# Altium schematic sheet AUC3.SchDoc
size A4
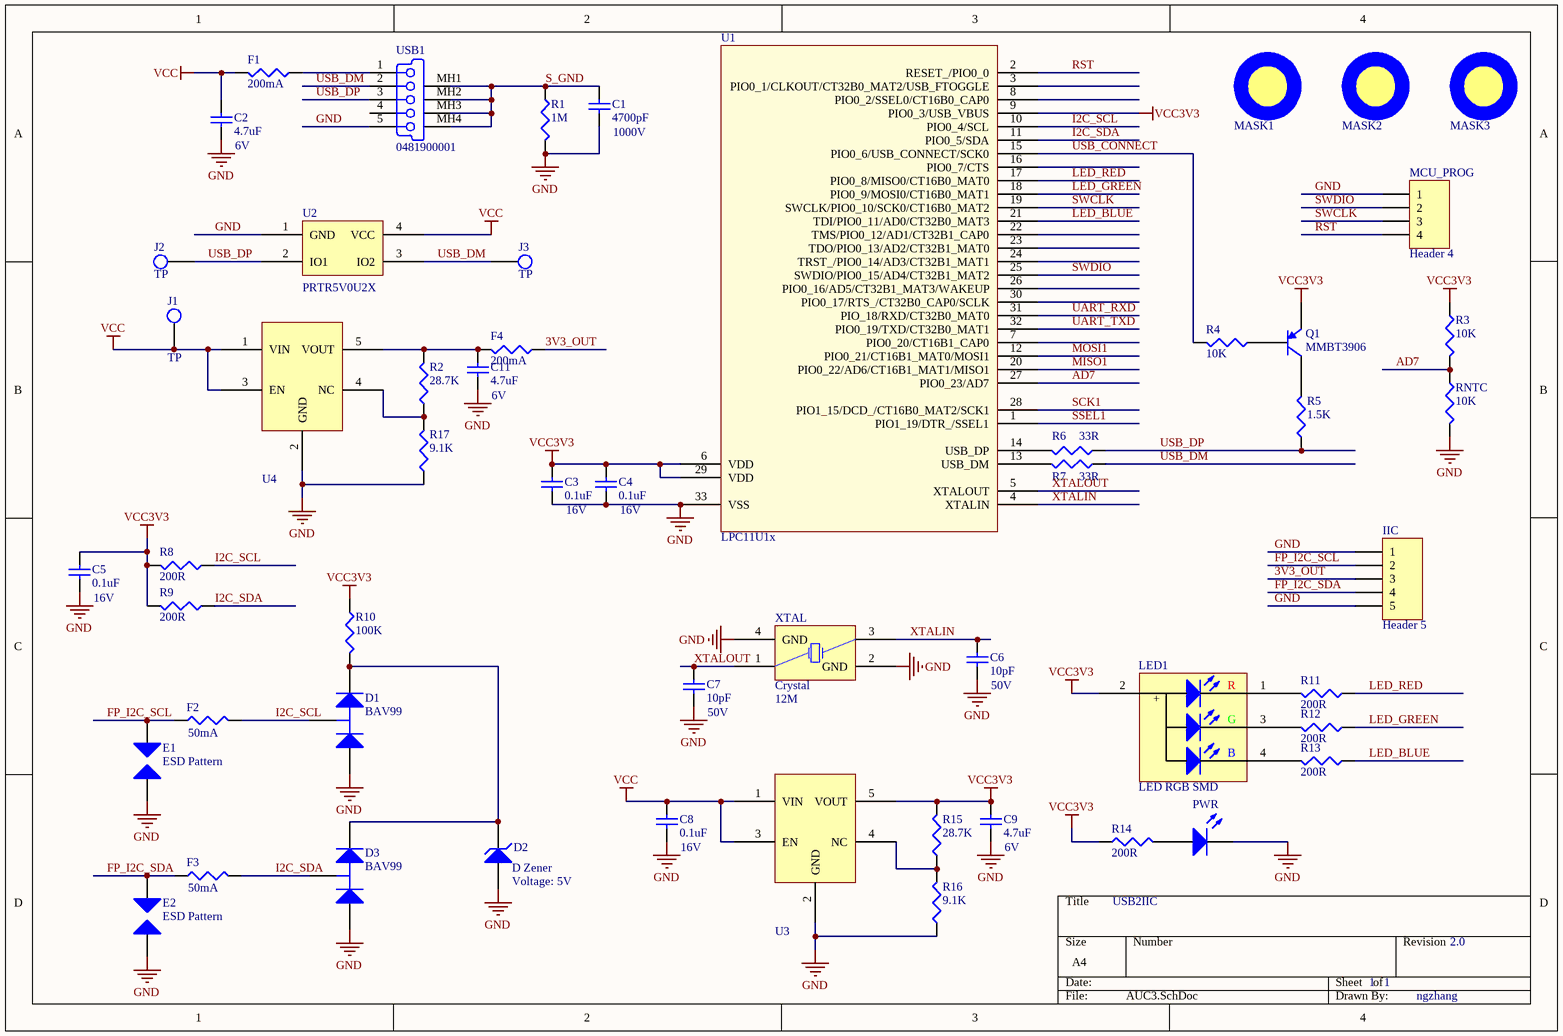
[diagram p0: AUC3.SchDoc]

## Parts
C1  Voltage: 1000V  [CAPC3216L]  (hidden comment: 4700pF)
C2  Voltage: 6V  [CAPC1608L]  (hidden comment: 4.7uF)
C3  Voltage: 16V  [CAPC1005L]  (hidden comment: 0.1uF)
C4  Voltage: 16V  [CAPC1005L]  (hidden comment: 0.1uF)
C5  Voltage: 16V  [CAPC1005L]  (hidden comment: 0.1uF)
C6  Voltage: 50V  [CAPC1005L]  (hidden comment: 10pF)
C7  Voltage: 50V  [CAPC1005L]  (hidden comment: 10pF)
C8  Voltage: 16V  [CAPC1005L]  (hidden comment: 0.1uF)
C9  Voltage: 6V  [CAPC1608L]  (hidden comment: 4.7uF)
C11  Voltage: 6V  [CAPC1608L]  (hidden comment: 4.7uF)
D1  BAV99  [SOT-23_L]
D2  D Zener  Voltage: 5V  [DO-214AC]
D3  BAV99  [SOT-23_L]
E1  ESD Pattern  [ESD]
E2  ESD Pattern  [ESD]
F1  200mA  [RESC3216L]
F2  50mA  [RESC2012l]
F3  50mA  [RESC2012l]
F4  200mA  [RESC3216L]
IIC  Header 5  [HDR1X50-s]
J1  TP  [tp]
J2  TP  [tp]
J3  TP  [tp]
LED1  LED RGB SMD  [LED3528RGB]
MASK1  MASK  [MASK_L]  (value not drawn)
MASK2  MASK  [MASK_L]  (value not drawn)
MASK3  MASK  [MASKTEST]  (value not drawn)
MCU_PROG  Header 4  [HDR1X4]
PWR  LED3  [CD1608-0603]  (value not drawn)
Q1  MMBT3906  [SOT23_N]
R1  1M  [RESC3216L]
R2  28.7K  [RESC1005L]
R3  10K  [RESC1005L]
R4  10K  [RESC1005L]
R5  1.5K  [RESC1005L]
R6  33R  [RESC1005L]
R7  33R  [RESC1005L]
R8  200R  [RESC1005L]
R9  200R  [RESC1005L]
R10  100K  [RESC1005L]
R11  200R  [RESC1005L]
R12  200R  [RESC1005L]
R13  200R  [RESC1005L]
R14  200R  [RESC1005L]
R15  28.7K  [RESC1005L]
R16  9.1K  [RESC1005L]
R17  9.1K  [RESC1005L]
RNTC  10K  [RESC1608L]
U1  LPC11U1x  [HVQFN33]
U2  PRTR5V0U2X  [SOT143B_L]
U3  LDO  [SOT23-5AL]  (value not drawn)
U4  LDO  [SOT23-5AL]  (value not drawn)
USB1  0481900001  [USB_Micro_B2]
XTAL  Crystal  value 12M  [XO2520]

## Nets
GND: C1.1 C2.2 C3.2 C4.2 C5.2 C6.2 C7.2 C8.2 C9.2 C11.2 D1.1(A) D2.1(A) D3.1(A) E1.1 E2.1 IIC.1 IIC.5 MCU_PROG.1 PWR.2(K) R1.2 R16.1 R17.1 RNTC.2 U1.33(VSS) U2.1(GND) U3.2(GND) U4.2(GND) USB1.5(GND) XTAL.2(GND) XTAL.4(GND)
VCC: C2.1 C8.1 F1.2 J1.1 U2.4(VCC) U3.1(VIN) U3.3(EN) U4.1(VIN) U4.3(EN)
VCC3V3: C3.1 C4.1 C5.1 C9.1 LED1.2(COM+) Q1.2(E) R3.1 R8.2 R9.2 R10.1 R14.1 R15.2 U1.6(VDD) U1.9(PIO0_3/USB_VBUS) U1.29(VDD) U3.5(VOUT)
3V3_OUT: F4.1 IIC.3
AD7: R3.2 RNTC.1 U1.27(PIO0_23/AD7)
FP_I2C_SCL: E1.2 F2.1 IIC.2
FP_I2C_SDA: E2.2 F3.1 IIC.4
I2C_SCL: D1.3(C) F2.2 R8.1 U1.10(PIO0_4/SCL)
I2C_SDA: D3.3(C) F3.2 R9.1 U1.11(PIO0_5/SDA)
LED_BLUE: R13.1 U1.21(TDI/PIO0_11/AD0/CT32B0_MAT3)
LED_GREEN: R12.1 U1.18(PIO0_9/MOSI0/CT16B0_MAT1)
LED_RED: R11.1 U1.17(PIO0_8/MISO0/CT16B0_MAT0)
MISO1: U1.20(PIO0_22/AD6/CT16B1_MAT1/MISO1)
MOSI1: U1.12(PIO0_21/CT16B1_MAT0/MOSI1)
RST: MCU_PROG.4 U1.2(RESET_/PIO0_0)
S_GND: C1.2 R1.1 USB1.MH1(Tab) USB1.MH2(Tab) USB1.MH3(Tab) USB1.MH4(Tab)
SCK1: U1.28(PIO1_15/DCD_/CT16B0_MAT2/SCK1)
SSEL1: U1.1(PIO1_19/DTR_/SSEL1)
SWCLK: MCU_PROG.3 U1.19(SWCLK/PIO0_10/SCK0/CT16B0_MAT2)
SWDIO: MCU_PROG.2 U1.25(SWDIO/PIO0_15/AD4/CT32B1_MAT2)
UART_RXD: U1.31(PIO_18/RXD/CT32B0_MAT0)
UART_TXD: U1.32(PIO0_19/TXD/CT32B0_MAT1)
USB_CONNECT: R4.2 U1.15(PIO0_6/USB_CONNECT/SCK0)
USB_DM: J3.1 R7.1 U2.3(IO2) USB1.2(D-)
USB_DP: J2.1 R5.1 R6.1 U2.2(IO1) USB1.3(D+)
XTALIN: C6.1 U1.4(XTALIN) XTAL.3(OSC2)
XTALOUT: C7.1 U1.5(XTALOUT) XTAL.1(OSC1)
NetC11_1: C11.1 F4.2 R2.2 U4.5(VOUT)
NetD1_2: D1.2(K) D2.2(K) D3.2(K) R10.2
NetF1_1: F1.1 USB1.1(V_BUS_(5V))
NetLED1_1: LED1.1(R) R11.2
NetLED1_3: LED1.3(G) R12.2
NetLED1_4: LED1.4(B) R13.2
NetPWR_1: PWR.1(A) R14.2
NetQ1_1: Q1.1(B) R4.1
NetQ1_3: Q1.3(C) R5.2
NetR2_1: R2.1 R17.2 U4.4(NC)
NetR6_2: R6.2 U1.14(USB_DP)
NetR7_2: R7.2 U1.13(USB_DM)
NetR15_1: R15.1 R16.2 U3.4(NC)

Not connected (* = marked no-connect by the designer): U1 3(PIO0_1/CLKOUT/CT32B0_MAT2/USB_FTOGGLE) 7(PIO0_20/CT16B1_CAP0) 8(PIO0_2/SSEL0/CT16B0_CAP0) 16(PIO0_7/CTS) 22(TMS/PIO0_12/AD1/CT32B1_CAP0) 23(TDO/PIO0_13/AD2/CT32B1_MAT0) 24(TRST_/PIO0_14/AD3/CT32B1_MAT1) 26(PIO0_16/AD5/CT32B1_MAT3/WAKEUP) 30(PIO0_17/RTS_/CT32B0_CAP0/SCLK); USB1 4(NC)

## Notes on the sheet
- USB2IIC
- 1   1
- 2.0
- ngzhang
- (in symbol LED3528RGB) +

## Library data of the parts
C1-C9 C11 = Cap Semi: Capacitor (Semiconductor SIM Model); Published: 8-Jun-2000; LatestRevisionDate: 29-May-2009; LatestRevisionNote: IPC-7351 Footprint Added.; PackageReference: C1206; Publisher: Altium Limited; PackageDescription: Chip Capacitor
  C1: Value: 4700pF
  C2 C9 C11: Value: 4.7uF
  C3-C5 C8: Value: 0.1uF
  C6 C7: Value: 10pF
D1 D3 = BAV99: Silicon Switching Diode Array for High-Speed Switching; Published: 21-Mar-2003; DatasheetDocument: Oct-1999; PackageDocument: Sep-2001; PackageReference: SOT-23; Publisher: Altium Limited; ComponentLink1Description: Manufacturer Link; ComponentLink1URL: http://www.infineon.com/; ComponentLink2Description: Datasheet; ComponentLink2URL: http://www.infineon.com/upload/Document/cmc_upload/documents/080/631/bav99series_1.pdf
D2 = D Zener: Zener Diode; Published: 8-Jun-2000; LatestRevisionDate: 17-Jul-2002; LatestRevisionNote: Re-released for DXP Platform.; PackageReference: DIODE-0.7; Publisher: Altium Limited; PackageDescription: Diode, Thru-Hole; 2 Leads; 0.7 in Pin Spacing
E1 E2 = ESD
F1-F4 R1-R17 RNTC = Res3: Resistor; Published: 8-Jun-2000; LatestRevisionDate: 29-May-2009; LatestRevisionNote: IPC-7351 Footprint Added.; PackageReference: J1-0603; Publisher: Altium Limited; PackageDescription: Chip Resistor
  F1 F4: Value: 200mA
  F2 F3: Value: 50mA
  R1: Value: 1M
  R2 R15: Value: 28.7K
  R3 R4 RNTC: Value: 10K
  R5: Value: 1.5K
  R6 R7: Value: 33R
  R8 R9 R11-R14: Value: 200R
  R10: Value: 100K
  R16 R17: Value: 9.1K
IIC = Header 5: Header, 5-Pin; LatestRevisionDate: 17-Jul-2002; LatestRevisionNote: Re-released for DXP Platform.; Publisher: Altium Limited
LED1 = LED3528RGB
MCU_PROG = Header 4: Header, 4-Pin; LatestRevisionDate: 17-Jul-2002; LatestRevisionNote: Re-released for DXP Platform.; Publisher: Altium Limited
PWR = LED3: Typical GREEN SiC LED; Published: 8-Jun-2000; LatestRevisionDate: 17-Dec-2003; LatestRevisionNote: PCB Footprint replaced.; DatasheetVersion: 16-Apr-2002; PackageVersion: 16-Apr-2002; PackageReference: 3.5X2.8X1.9; Publisher: Altium Limited; PackageDescription: SM LED; 2 C-Bend Leads; Body 3.5 x 2.8 x 1.9 mm, inc leads (LxWxH typ); Color: Green
Q1 = MMBT3906: PNP Switching Transistor; Published: 17-Sep-2003; LatestRevisionDate: 12-Dec-2006; LatestRevisionNote: IPC-7351 Footprint Added.; DatasheetVersion: 11-Apr-2000; PackageVersion: May-1999; PackageReference: SOT23; Publisher: Altium Limited; PackageDescription: 3-Pin SOT-23 Package 0.95 mm Pitch, 2.3 mm Lead Span; ComponentLink1Description: Manufacturer Link; ComponentLink1URL: http://www.semiconductors.philips.com/; ComponentLink2Description: Datasheet; ComponentLink2URL: http://www.semiconductors.philips.com/acrobat/datasheets/MMBT3906_2.pdf
U1 = LPC11U1x: 32-bit ARM Cortex-M0 microcontroller
U2 = PRTR5V0U2X: Ultra low capacitance double rail-to-rail ESD protection diode
U3 U4 = RT9187C: 600mA, Ultra-Low Dropout, CMOS Regulatorout Bypass Capacitor CMOS LDO Regulator
USB1 = 0481900001: USB On-The-Go (OTG) Mini-B Receptacle, Right Angle, SMT, 0.80mm (.031") Pitch, Solder Tabs with Back Cover, Recessed Type; PCB_Layout: Complies with Manufacturer's Recommendation.; Published: 21-Sep-2007; DatasheetVersion: revA, May-2004; PackageVersion: May-2004; PackageReference: 481900001; Publisher: Altium Limited; PackageDescription: USB Mini-B, Sinking Type, SM; 5 Position; Right Angle, Body 11.45 x 11.8 x 3.9 mm (LxWxH); ComponentLink1Description: Manufacturer Link; ComponentLink1URL: http://www.molex.com/; ComponentLink2Description: Datasheet; ComponentLink2URL: http://www.molex.com/cmc_upload/0/000/895/958/SD-48190-001RevA.pdf
XTAL = Crystal SMD
J1-J3 = TP: LatestRevisionDate: 17-Jul-2002; LatestRevisionNote: Re-released for DXP Platform.; Publisher: Altium Limited